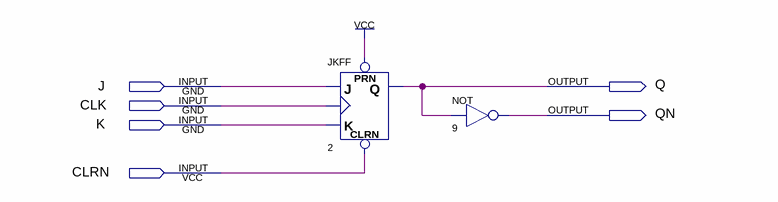
[diagram p0: schematic sheet]
// Quartus schematic JK_FllpFiop.bdf as structural Verilog: 2 symbols, 6 pins
module JK_FllpFiop (
  input  J,
  input  CLK,
  input  K,
  input  CLRN,
  output Q,
  output QN
);

  JKFF u_2 (.PRN(1'b1), .CLRN(CLRN), .K(K), .J(J), .CLK(CLK), .Q(Q));
  not u_9 (QN, Q);
endmodule
